# EAGLE design Plastic_welder_heater-3.1 (EAGLE 5.10)
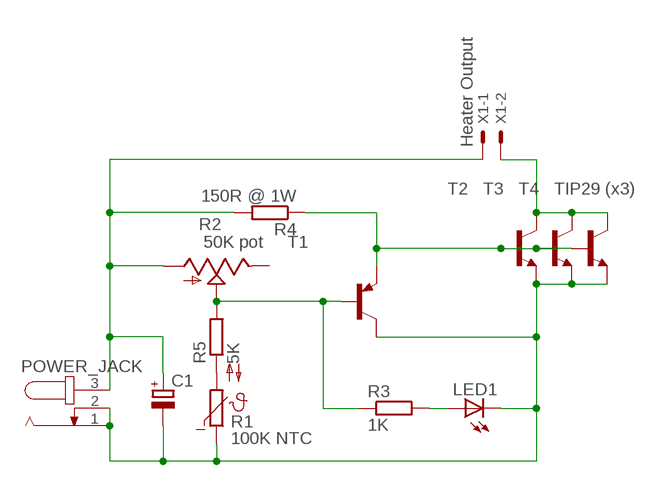
[diagram p0: schematic, sheet 1]

## Parts
C1  CPOL-EUE3.5-8  [E3,5-8]
LED1  LED3MM  [LED3MM]
POWER_JACK  JACK-PLUG0  [SPC4077]
R1  100K NTC  NTC640  [P640]
R2  50K pot  TRIM_US-CA9V  [CA9V]
R3  1K  R-EU_0207/10  [0207/10]
R4  150R @ 1W  R-EU_0207/10  [0207/10]
R5  5K  R-EU_0207/2V  [0207/2V]
T1  2N3251  [TO18]
T2  2N5496  [TO220]
T3  2N5496  [TO220]
T4  2N5496  [TO220]
X1  Heater Output  22-23-2021  [22-23-2021]

## Nets
N$1: R2.S R3.1 R5.2 T1.2(B)
N$2: C1.+ POWER_JACK.3 R2.A R4.2 X1.1
N$3: R4.1 T1.1(E) T2.1(B) T3.1(B) T4.1(B)
N$4: T2.2(C) T3.2(C) T4.2(C) X1.2
N$5: LED1.A R3.2
N$6: C1.- LED1.K(C) POWER_JACK.1 POWER_JACK.2 R1.1 T1.3(C) T2.3(E) T3.3(E) T4.3(E)
N$8: R1.2 R5.1
Unconnected: R2.E

## Notes on the sheet
- TIP29 (x3)

## Library data of the parts
C1 = resistor:CPOL-EU: POLARIZED CAPACITOR, European symbol
LED1 = led:LED: LED OSRAM: - CHIPLED LG R971, LG N971, LY N971, LG Q971, LY Q971, LO R971, LY R971 LH N974, LH R974 LS Q976, LO Q976, LY Q976 LO Q996 - Hyper CHIPLED LW Q18S LB Q993, LB Q99A, LB R99A - SideLED LS A670, LO A670, LY A670, LG A670, LP A670 LB A673, LV A673, LT A673, LW A673 LH A674 LY A675 LS A676, LA A676, LO A676, LY A676, LW A676 LS A679, LY A679, LG A679 - Hyper Micro SIDELED® LS Y876, LA Y876, LO Y876, LY Y876 LT Y87S - SmartLED LW L88C, LW L88S LB L89C, LB L89S, LG L890 LS L89K, LO L89K, LY L89K LS L896, LA L896, LO L896, LY L896 - TOPLED LS T670, LO T670, LY T670, LG T670, LP T670 LSG T670, LSP T670, LSY T670, LOP T670, LYG T670 LG T671, LOG T671, LSG T671 LB T673, LV T673, LT T673, LW T673 LH T674 LS T676, LA T676, LO T676, LY T676, LB T676, LH T676, LSB T676, LW T676 LB T67C, LV T67C, LT T67C, LS T67K, LO T67K, LY T67K, LW E67C LS E67B, LA E67B, LO E67B, LY E67B, LB E67C, LV E67C, LT E67C LW T67C LS T679, LY T679, LG T679 LS T770, LO T770, LY T770, LG T770, LP T770 LB T773, LV T773, LT T773, LW T773 LH T774 LS E675, LA E675, LY E675, LS T675 LS T776, LA T776, LO T776, LY T776, LB T776 LHGB T686 LT T68C, LB T68C - Hyper Mini TOPLED® LB M676 - Mini TOPLED Santana® LG M470 LS M47K, LO M47K, LY M47K Source: http://www.osram.convergy.de LUXEON: - LUMILED® LXK2-PW12-R00, LXK2-PW12-S00, LXK2-PW14-U00, LXK2-PW14-V00 LXK2-PM12-R00, LXK2-PM12-S00, LXK2-PM14-U00 LXK2-PE12-Q00, LXK2-PE12-R00, LXK2-PE12-S00, LXK2-PE14-T00, LXK2-PE14-U00 LXK2-PB12-K00, LXK2-PB12-L00, LXK2-PB12-M00, LXK2-PB14-N00, LXK2-PB14-P00, LXK2-PB14-Q00 LXK2-PR12-L00, LXK2-PR12-M00, LXK2-PR14-Q00, LXK2-PR14-R00 LXK2-PD12-Q00, LXK2-PD12-R00, LXK2-PD12-S00 LXK2-PH12-R00, LXK2-PH12-S00 LXK2-PL12-P00, LXK2-PL12-Q00, LXK2-PL12-R00 Source: www.luxeon.com KINGBRIGHT: KA-3528ASYC Source: www.kingbright.com
POWER_JACK = con-jack:JACK-PLUG: DC POWER JACK Power Jack, DC, Right Angle, Through Hole, Rated 5A at 16VDC, PC Terminals Distributor: Farnell (www.Farnell.de) Drawing: 84N1161.pdf / 84N1162.pdf Manufacturer: SPC Technology (www.spctechnology.com) Type: SPC4077 / SPC 4078
R1 = ptc-ntc:NTC640: PHILIPS NTC
R2 = pot:TRIM_US-: POTENTIOMETER
R3-R5 = rcl:R-EU_: RESISTOR, European symbol
T1 = transistor-pnp:2N3251: PNP Transistror
T2-T4 = transistor-neu-to92:2N5496: NPN TRANSISTOR
X1 = con-molex:22-23-2021: .100" (2.54mm) Center Header - 2 Pin

## Board
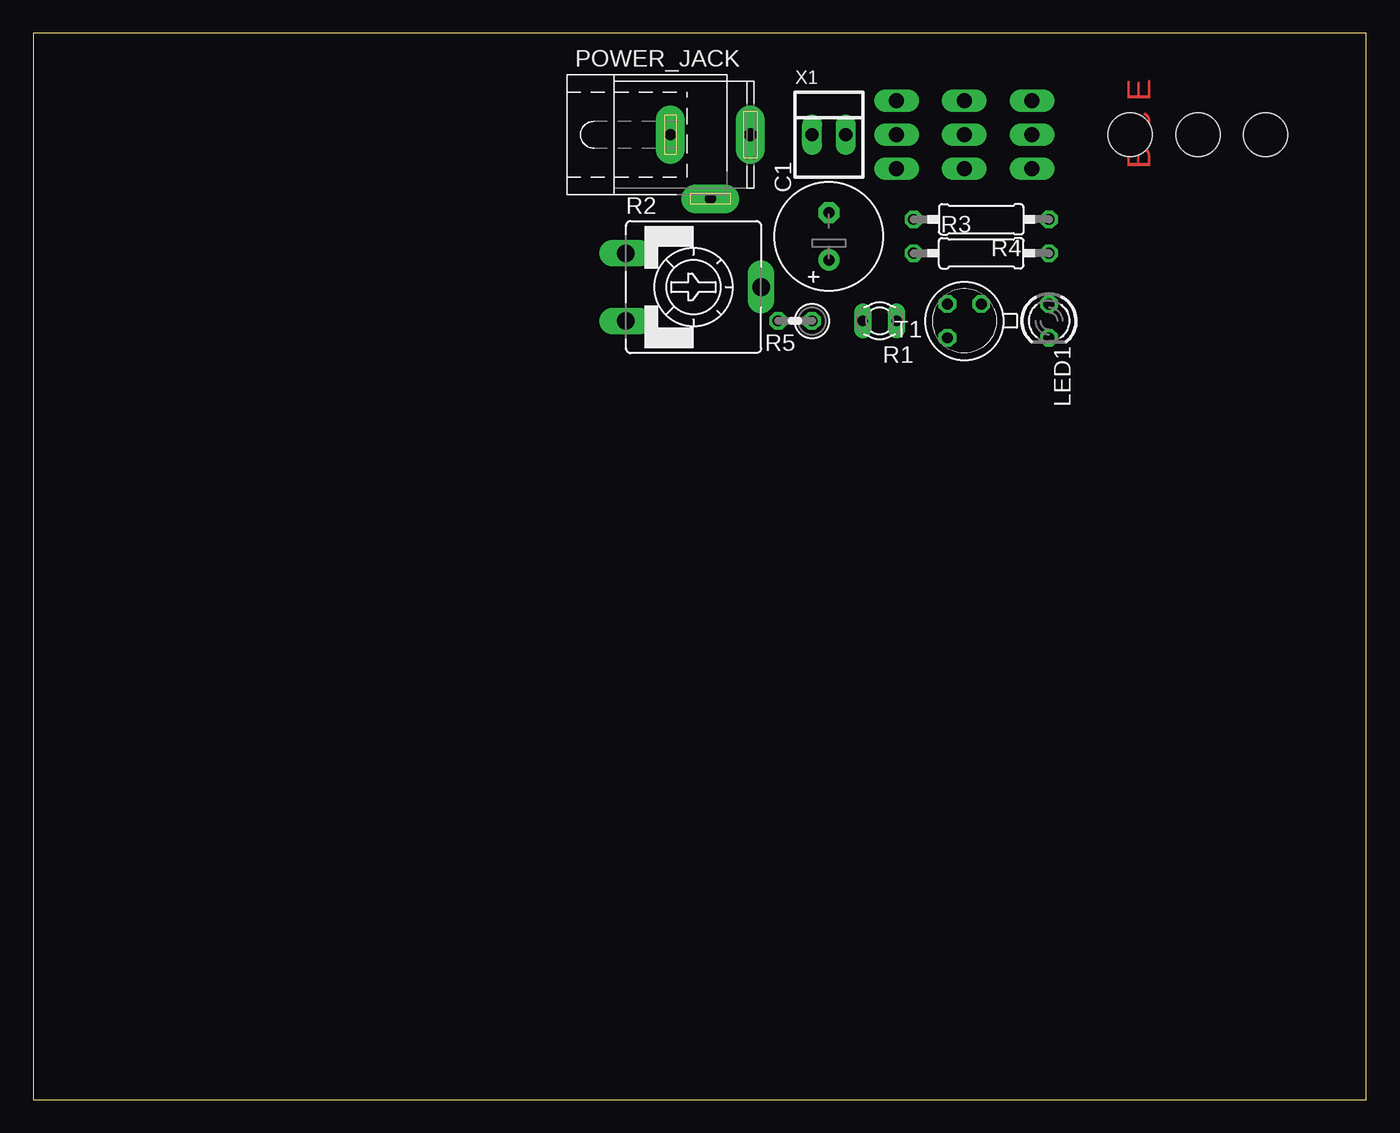
[diagram p1: board, top side]
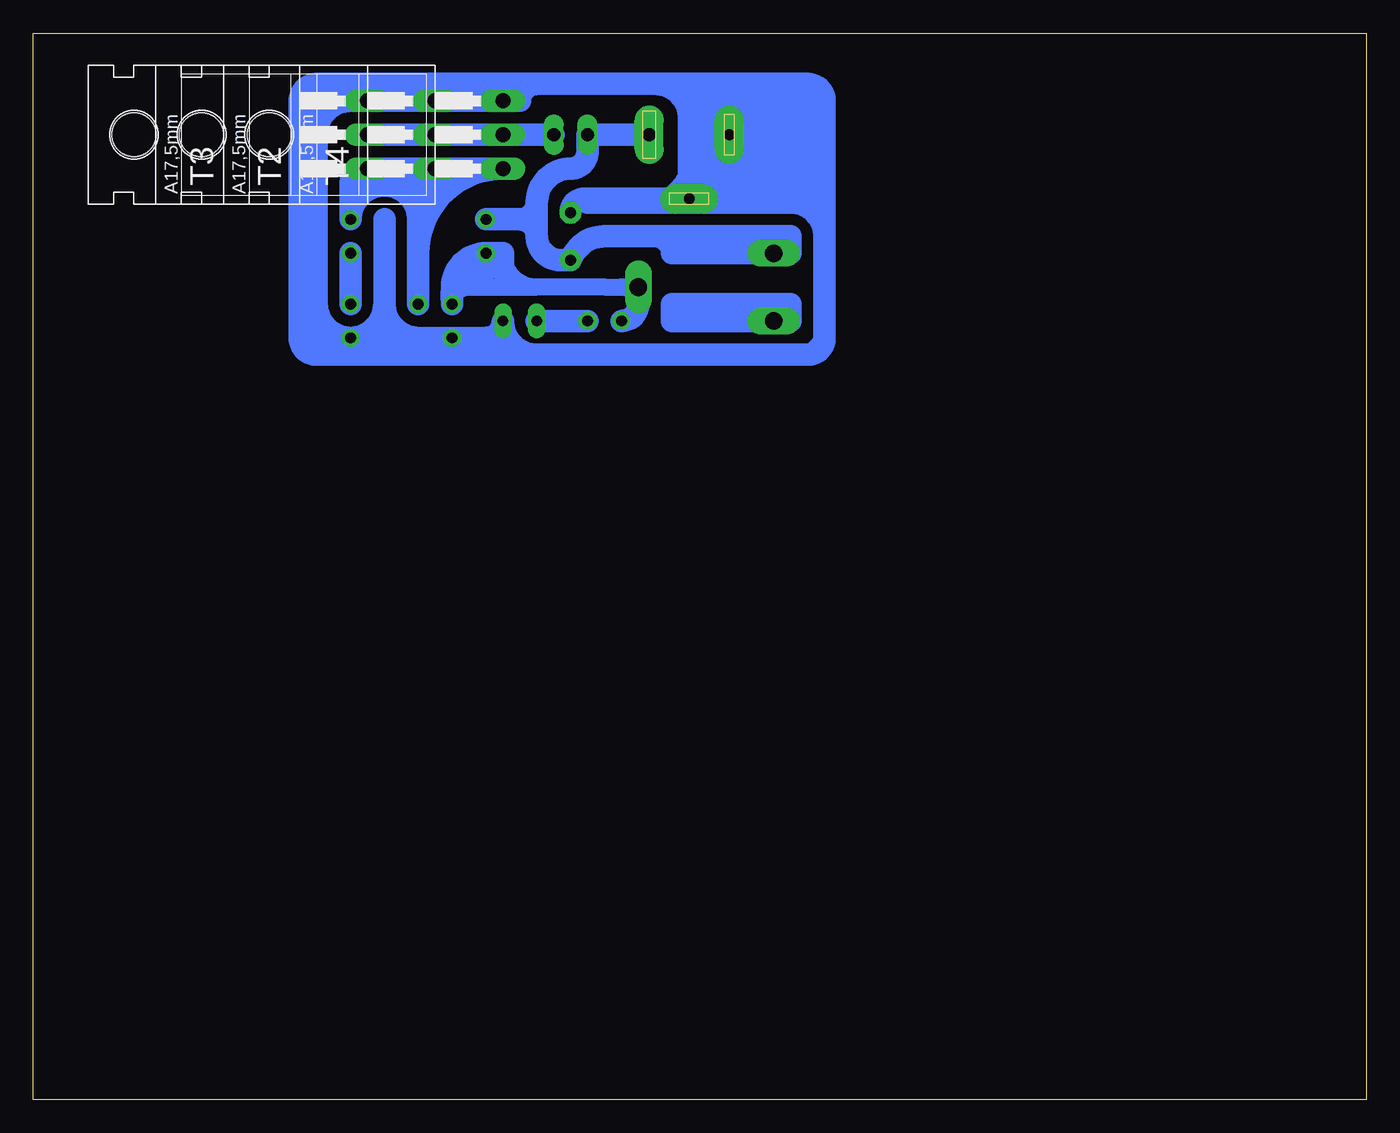
[diagram p2: board, bottom side, seen from below]

Size 100 x 80 mm. Coordinates in mm from the lower left corner, seen from the top.
Outline: 0,0 100,0 100,80 0,80 0,0
Copper layers (1*16): Top 0.035mm / dielectric 1.5mm / Bottom 0.035mm
Design rules "default": minimum track width 10mil, minimum drill 24mil, track to track 8mil, track to pad 8mil, pad to pad 8mil, via to via 8mil, smd to smd 8mil, copper to edge 40mil, drill to drill 8mil, minimum pad ring 10mil, minimum via ring 8mil, stop-mask expansion 4mil, vias tented up to drill 0mil, thermal gap 10mil

### Footprints (pad centres in the part's own frame; a part is rotated, then mirrored left to right if it is on the bottom)
E3,5-8 = drill 0.813 pad 1.6 round: + -1.778,0 | drill 0.813 pad 1.6 octagon: - 1.778,0
LED3MM = drill 0.813 octagon: A -1.27,0; K 1.27,0
SPC4077 = drill 0.8 pad 2.184 long: 1 -3,0; 2 0,-4.8 | drill 1 pad 2.184 long: 3 3,0
P640 = drill 0.813 long: 1 -1.27,0; 2 1.27,0
CA9V = drill 1.321 long: A -2.54,-5.08; E 2.54,-5.08; S 0,5.08
0207/10 = drill 0.813 octagon: 1 -5.08,0; 2 5.08,0
0207/2V = drill 0.813 octagon: 1 -1.27,0; 2 1.27,0
TO18 = drill 0.813 octagon: 1 -1.27,-1.27; 2 1.27,-1.27; 3 1.27,1.27
TO220 = drill 1.118 long: 1 -2.54,-6.35; 2 0,-6.35; 3 2.54,-6.35 | hole 3.302: 0,11.176
22-23-2021 = drill 1 long: 1 -1.27,0; 2 1.27,0

### Placement (x,y rotation side)
C1  59.69,64.77 90 top
LED1  76.2,58.42 270 top
POWER_JACK  50.8,72.39 0 top
R1  63.5,58.42 180 top
R2  49.53,60.96 270 top
R3  71.12,63.5 0 top
R4  71.12,66.04 180 top
R5  57.15,58.42 180 top
T1  69.85,58.42 180 top
T2  76.2,72.39 90 bottom
T3  81.28,72.39 90 bottom
T4  71.12,72.39 90 bottom
X1  59.69,72.39 0 top

### Tracks (layer width: path | path; a pad name or v marks a point on that pad's centre or on a via)
N$1
  Bottom 1.27: 67.31,60.96 68.58,60.96 arc-90 T1.2 arc90 67.31,60.96 | 64.77,63.5 arc-90 62.23,60.96 | R2.S 55.88,60.96 | 62.23,60.96 57.15,60.96 55.88,60.96 | 67.31,60.96 62.23,60.96 | 55.88,60.96 arc90 54.61,59.69
  Bottom 1.676: 68.58,60.96 arc90 R3.1 | 54.61,59.69 arc90 R5.2 arc-90 54.61,59.69 | 54.61,59.69 R2.S | 68.58,60.96 arc90 66.04,62.23 R3.1 | R3.1 arc-90 68.58,60.96 | T1.2 68.58,60.96 | 68.58,60.96 arc90 67.31,62.23 | R3.1 64.77,63.5 64.77,62.23 arc-90 68.58,60.96
N$2
  Bottom 1.676: POWER_JACK.3 X1.1 58.42,71.12 arc90 59.69,69.85 arc-90 62.23,67.31 | 63.5,66.04 arc-90 62.23,67.31 | 63.5,66.04 R4.2 | 62.23,64.77 arc-90 63.5,66.04 | 62.23,64.77 arc-90 60.45,62.99 C1.+ arc70 57.15,64.77 53.34,64.77 | R2.A arc-90 45.72,64.77 | 45.72,64.77 52.07,64.77 | 52.07,64.77 53.34,64.77 | 62.23,64.77 62.23,67.31 | 45.72,64.77 43.18,64.77 43.18,63.5 52.07,63.5 | 52.07,64.77 52.07,63.5 | 53.34,64.77 arc90 52.07,63.5
N$3
  Bottom 1.676: T2.1 T4.1 arc-90 71.12,63.5 T1.1 71.12,66.04 | T2.1 T3.1 | T3.1 arc-90 76.2,68.58 | 76.2,68.58 R4.1 | 71.12,66.04 arc-90 T3.1 | T3.1 73.66,69.85 arc90 71.12,67.31 arc90 69.85,68.58 | T2.1 72.39,69.85 arc-90 R4.1 | 71.12,68.58 73.66,68.58 | 73.66,68.58 76.2,68.58 | R4.1 arc90 73.66,68.58 | 73.66,68.58 arc90 71.12,66.04
N$4
  Bottom 1.676: T3.2 T2.2 T4.2 X1.2
N$5
  Bottom 1.676: R3.2 LED1.A
N$6
  Bottom 0.813: 80.01,60.96 arc-90 74.93,55.88 | 40.64,58.42 40.64,57.15 arc90 41.91,55.88 43.18,55.88 arc-90 40.64,58.42 | 40.64,66.04 40.64,64.77 arc-90 43.18,67.31 41.91,67.31 | 40.64,66.04 arc-90 41.91,67.31 | 49.53,67.31 52.07,67.31 | 49.53,67.31 49.53,69.85 50.8,69.85 50.8,71.12 arc90 54.61,67.31 | 40.64,66.04 40.64,67.31 | 40.64,71.12 40.64,67.31 | 40.64,72.39 arc-90 44.45,76.2 44.45,71.12 arc-90 40.64,67.31 | 40.64,67.31 arc-90 41.91,68.58 arc-90 40.64,67.31 | 40.64,67.31 41.91,67.31 | 44.45,67.31 49.53,67.31 | 40.64,66.04 arc-90 41.91,67.31 | 40.64,58.42 40.64,62.23
  Bottom 1.27: 63.5,76.2 arc-90 T4.3
  Bottom 1.676: 48.26,71.12 48.26,72.39 | 50.8,68.58 arc-90 48.26,71.12 | 50.8,71.12 50.8,68.58 | 50.8,74.93 50.8,73.66 | 50.8,74.93 arc90 49.53,73.66 49.53,69.85 | 49.53,69.85 arc90 50.8,71.12 | LED1.K arc90 78.74,59.69 | 78.74,59.69 78.74,72.39 arc90 76.2,74.93 T3.3 T2.3 T4.3 63.5,74.93 arc90 62.23,76.2 | 51.61,76.2 arc90 POWER_JACK.1 47.8,70.59 arc90 POWER_JACK.2 58.65,67.59 arc-90 C1.- | 53.34,76.2 60.96,76.2 62.23,76.2 | 62.23,76.2 63.5,76.2 76.2,76.2 | 51.61,76.2 52.07,76.2 | 76.2,76.2 arc-90 80.01,72.39 | 80.01,72.39 80.01,60.96 | 80.01,60.96 arc-90 LED1.K | 53.34,76.2 arc90 50.8,73.66 | 52.07,76.2 53.34,76.2 | 52.07,76.2 arc90 50.8,74.93 | 50.8,71.12 50.8,73.66 | 49.53,69.85 50.8,68.58 | 49.53,69.85 48.26,71.12 | 44.45,76.2 51.61,76.2 | 44.45,76.2 arc90 41.91,73.66 41.91,68.58 48.26,68.58 48.26,74.93 43.18,74.93 43.18,69.85 46.99,69.85 46.99,71.12 | 46.99,71.12 46.99,73.66 44.45,73.66 44.45,71.12 46.99,71.12 | 46.99,71.12 arc90 45.72,72.39 | 80.01,60.96 arc-90 74.93,55.88 | 40.64,57.15 arc90 41.91,55.88 | 40.64,72.39 40.64,71.12 40.64,64.77 | 40.64,72.39 arc-90 44.45,76.2 | 44.45,76.2 41.91,76.2 arc90 40.64,74.93 40.64,72.39 | 40.64,57.15 40.64,62.23 40.64,64.77 | 40.64,57.15 arc90 41.91,55.88 | 74.93,55.88 78.74,55.88 arc90 80.01,57.15 80.01,60.96 | 80.01,72.39 80.01,74.93 arc90 78.74,76.2 76.2,76.2 | 58.42,67.31 44.45,67.31 43.18,67.31 | 40.64,64.77 arc-90 43.18,67.31 | 40.64,64.77 arc-90 43.18,67.31 | 74.93,55.88 69.85,55.88 | 69.85,55.88 arc-90 T1.3 arc-90 67.31,55.88 66.04,55.88 arc-90 64.77,57.15 R1.1 | 41.91,55.88 62.23,55.88 | 62.23,55.88 69.85,55.88 | 74.93,55.88 arc90 78.74,59.69 | 78.74,59.69 arc-90 LED1.K
  Bottom 1.676: LED1.K 71.12,57.15 | 71.12,57.15 66.04,57.15 arc-90 R1.1 | R1.1 arc-90 62.23,55.88 | 71.12,57.15 arc90 73.66,59.69 | 73.66,66.04 73.66,59.69 | 73.66,59.69 arc90 LED1.K
N$8
  Bottom 1.676: R5.1 R1.2
N$9
  Bottom 1.676: 43.18,58.42 52.07,58.42 52.07,59.69 43.18,59.69 43.18,58.42
(copper drawn outside any net)
  shapes: Bottom area x2

### Text on the board
Top: E | C | B